# Altium schematic sheet AVD_eFuse_HV_Ctrl.SchDoc: GEM AVD eFuse
size 420 x 297 mm; Author: G.Kasprowicz; CompanyName: WUT ISE; DrawnBy: G.Kasprowicz; Organization: WUT ISE; Address1: PW ISE; Address2: Nowowiejska 15/19 00-665 Warsaw; Address3: gkasprow@gmail.com; Revision: 2; SheetNumber: 3; SheetTotal: 6; ModifiedBy: -; CheckedDate: -; Title2: HV and control; DivGrp: WUT ISE; Designer: G.Kasprowicz; ModifiedDate: -; ProjectName: Sensor Box
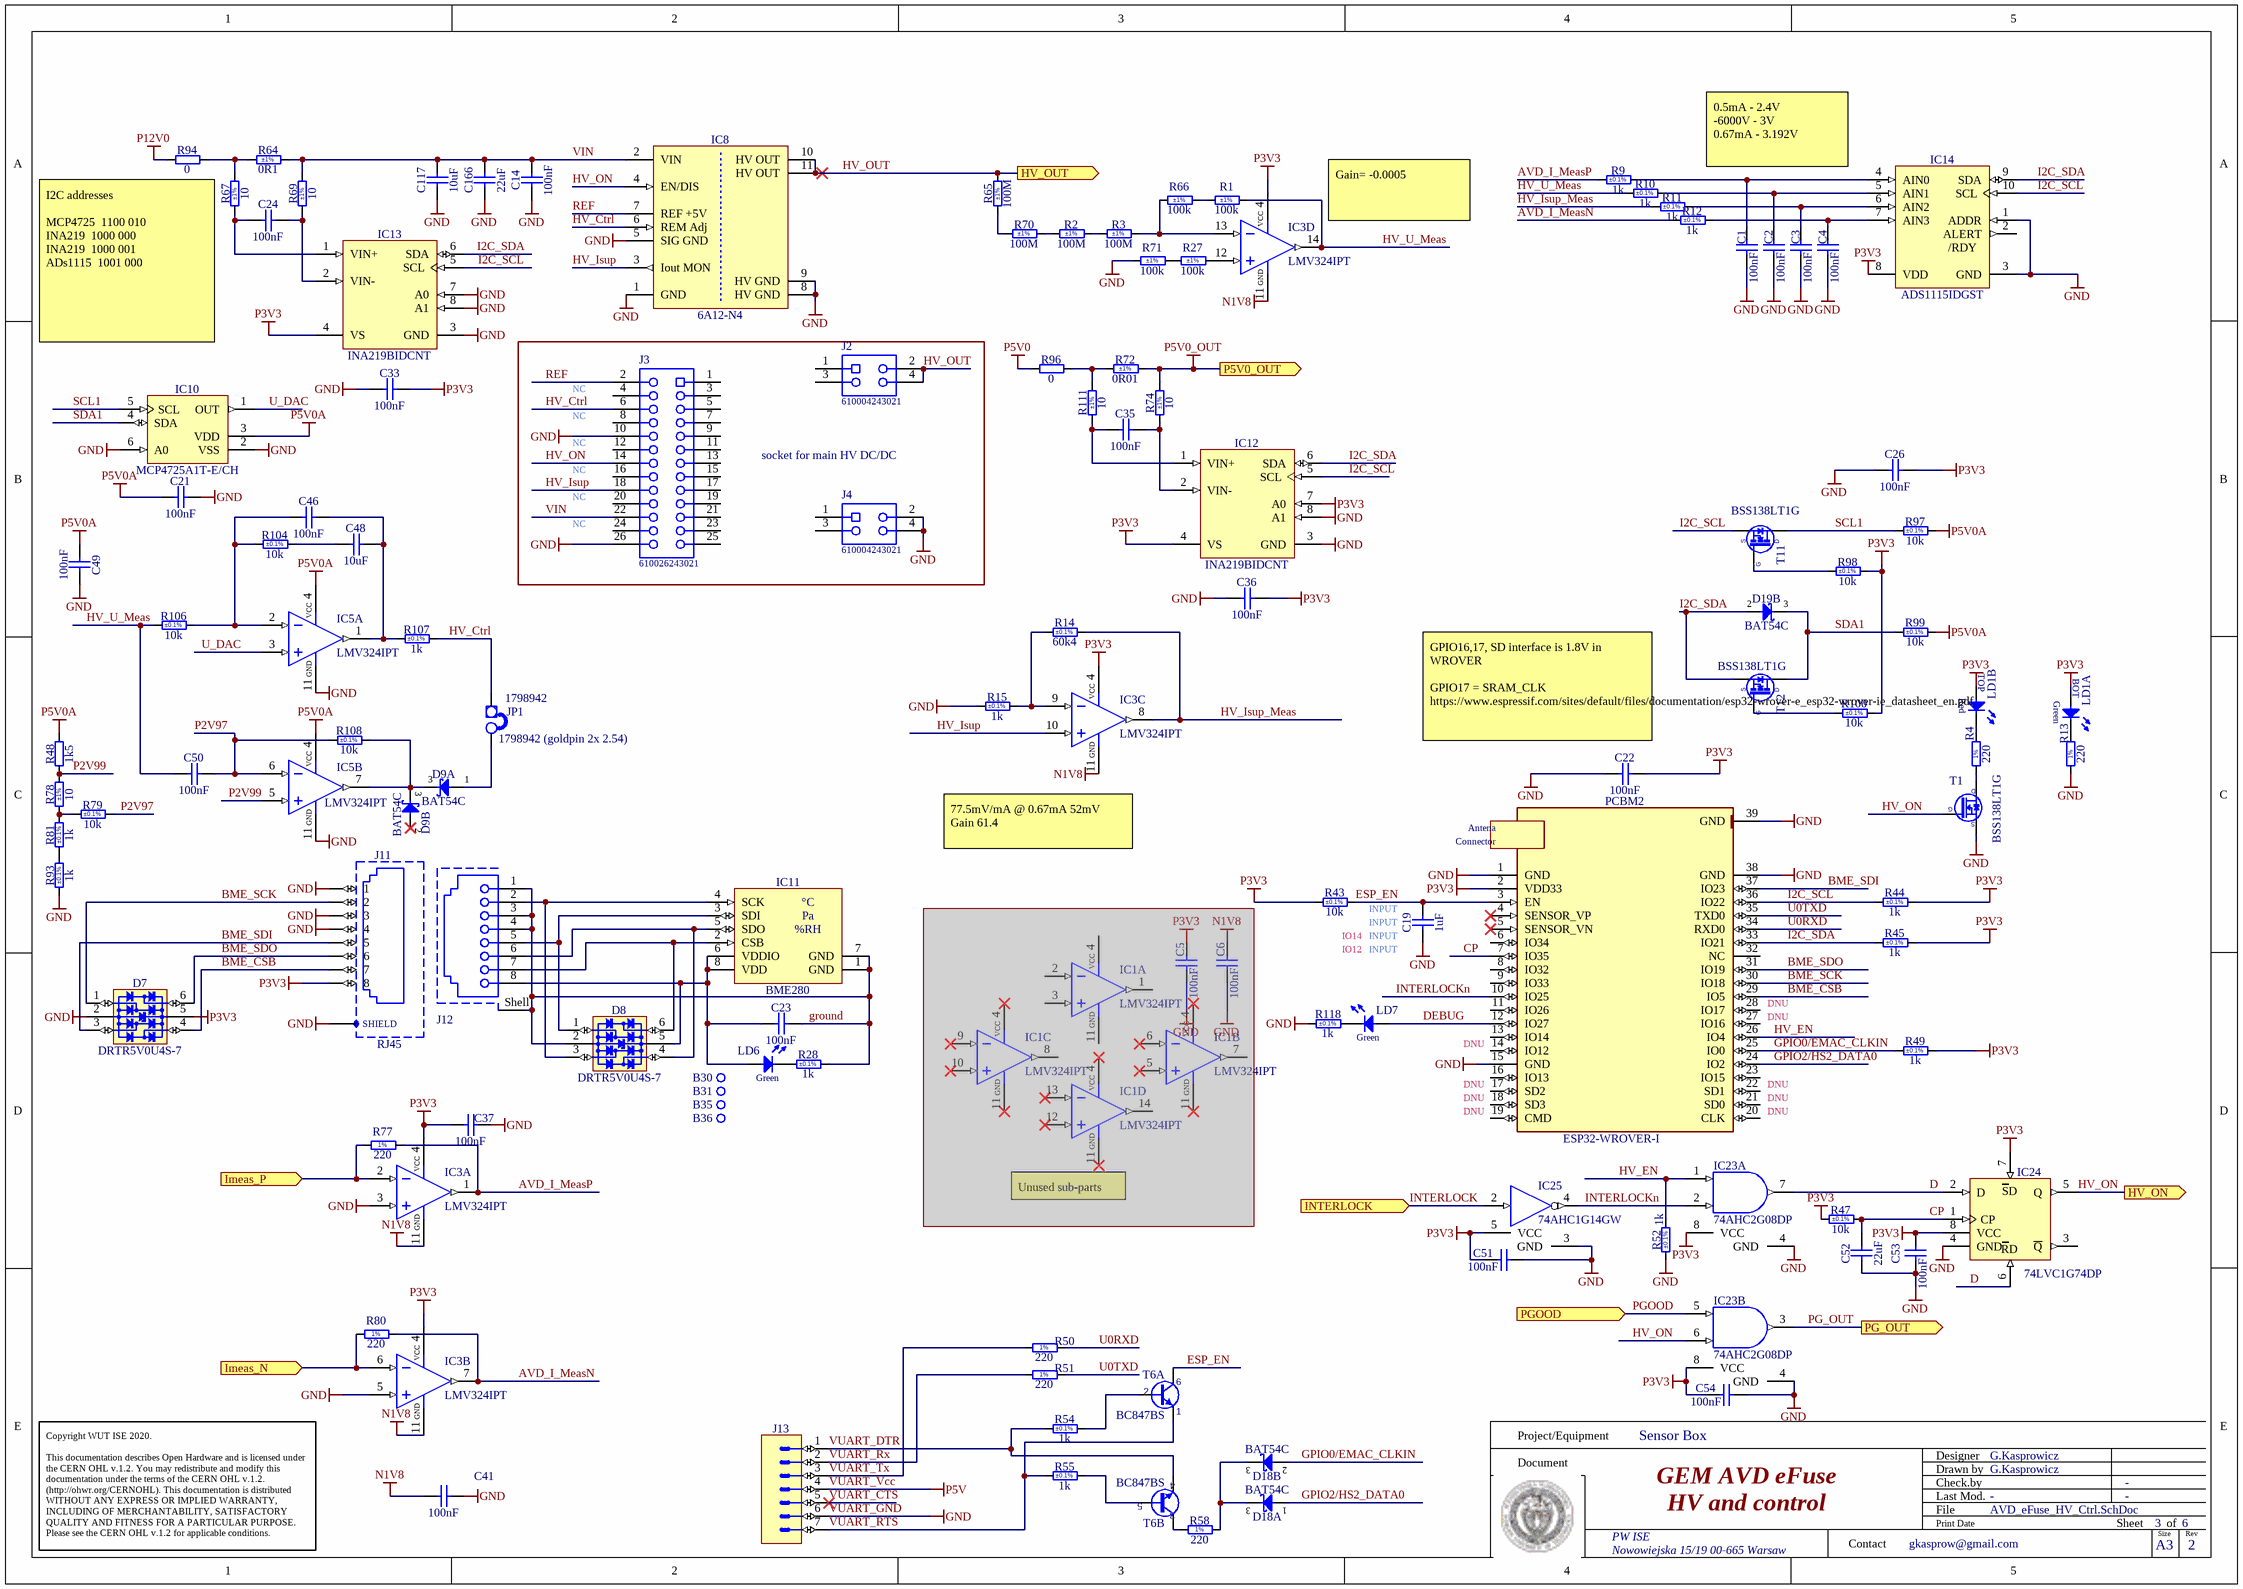
[diagram p0: AVD_eFuse_HV_Ctrl.SchDoc]

## Parts
B30  Plated Hole  [MTG320_550]  (value not drawn)  (no BOM)
B31  Plated Hole  [MTG320_550]  (value not drawn)  (no BOM)
B35  Plated Hole  [MTG320_550]  (value not drawn)  (no BOM)
B36  Plated Hole  [MTG320_550]  (value not drawn)  (no BOM)
C1  100nF  [CAPC1608X87N]
C2  100nF  [CAPC1608X87N]
C3  100nF  [CAPC1608X87N]
C4  100nF  [CAPC1608X87N]
C5  100nF  [CAPC1608X87N]  (masked out: inside a compile mask, not in the netlist)
C6  100nF  [CAPC1608X87N]  (masked out: inside a compile mask, not in the netlist)
C14  100nF  [CAPC1608X87N]
C19  1uF  [CAPC1608X87N]
C21  100nF  [CAPC1608X87N]
C22  100nF  [CAPC1608X87N]
C23  100nF  [CAPC1608X87N]
C24  100nF  [CAPC1608X87N]
C26  100nF  [CAPC1608X87N]
C33  100nF  [CAPC1608X87N]
C35  100nF  [CAPC1608X87N]
C36  100nF  [CAPC1608X87N]
C37  100nF  [CAPC1608X87N]
C41  100nF  [CAPC1608X87N]
C46  100nF  [CAPC1608X87N]
C48  10uF  [CAPC2012X135N]
C49  100nF  [CAPC1608X87N]
C50  100nF  [CAPC1608X87N]
C51  100nF  [CAPC1608X87N]
C52  22uF  [CAPC2012X135N]
C53  100nF  [CAPC1608X87N]
C54  100nF  [CAPC1608X87N]
C117  10uF  [CAPC2012X135N]
C166  22uF  [CAPC2012X135N]
D7  DRTR5V0U4S-7  [SOT65P210X110-6N]
D8  DRTR5V0U4S-7  [SOT65P210X110-6N]
D9  BAT54C  [SOT95P240X130-3N]  (parts A,B of 2)
D18  BAT54C  [SOT95P240X130-3N]  (parts A,B of 2)
D19  BAT54C  [SOT95P240X130-3N]  (part B of 2)
IC1  LMV324IPT  [SOP65P640X110-14N]  (parts A,B,C,D of 4)  (masked out: inside a compile mask, not in the netlist)
IC3  LMV324IPT  [SOP65P640X110-14N]  (parts A,B,C,D of 4)
IC5  LMV324IPT  [SOP65P640X110-14N]  (parts A,B of 4)
IC8  6A12-N4  [DCDC_ADVANCEDENERGY_6A12-N4]  (mechanical)
IC10  MCP4725A1T-E/CH  [SOT95P270X145-6N]
IC11  BME280  [BOSCH_BME280]
IC12  INA219BIDCNT  [SOT65P280X145-8N]
IC13  INA219BIDCNT  [SOT65P280X145-8N]
IC14  ADS1115IDGST  [SOP50P490X110-10N]
IC23  74AHC2G08DP  [SOP65P400X110-8N]  (parts A,B of 2)
IC24  74LVC1G74DP  [SOP65P400X110-8N]
IC25  74AHC1G14GW  [SOT65P212X110-5N]
J2  610004243021  [610004243021]
J3  610026243021  [610026243021]
J4  610004243021  [610004243021]
J11  RJ45  [WURTH_615 008 142 21]
J12  634108150321  [634108150321]  (value not drawn)
J13  Header 7  [SAMTEC_TSW-107-07-L-S-LL]  (value not drawn)
JP1  1798942 (goldpin 2x 2.54)  Manufacturer Part Number: 1798942  [jump]
LD1  Red/Green  [LED_DIALIGHT_553-0112-200F]  (value not drawn)  (parts A,B of 2)
LD6  Green  [LED_KINGBRIGHT_KP-1608CGCK]
LD7  Green  [LED_KINGBRIGHT_KP-1608CGCK]
PCBM2  ESP32-WROVER-I  [PCBM_ESP32-WROVER-I]
R1  100k  Tolerance: ±1%  [RESC1608X55N]
R2  100M  Tolerance: ±1%  [RES_VISHAY_CRHV2010A]
R3  100M  Tolerance: ±1%  [RES_VISHAY_CRHV2010A]
R4  220  [RESC1005X40N]
R9  1k  Tolerance: ±0.1%  [RESC1608X55N]
R10  1k  Tolerance: ±0.1%  [RESC1608X55N]
R11  1k  Tolerance: ±0.1%  [RESC1608X55N]
R12  1k  Tolerance: ±0.1%  [RESC1608X55N]
R13  220  [RESC1005X40N]
R14  60k4  Tolerance: ±0.1%  [RESC1608X55N]
R15  1k  Tolerance: ±0.1%  [RESC1608X55N]
R27  100k  Tolerance: ±1%  [RESC1608X55N]
R28  1k  Tolerance: ±0.1%  [RESC1608X55N]
R43  10k  Tolerance: ±0.1%  [RESC1608X64N]
R44  1k  Tolerance: ±0.1%  [RESC1608X55N]
R45  1k  Tolerance: ±0.1%  [RESC1608X55N]
R47  10k  Tolerance: ±0.1%  [RESC1608X64N]
R48  1k5  [RESC1005X40N]
R49  1k  Tolerance: ±0.1%  [RESC1608X55N]
R50  220  [RESC1005X40N]
R51  220  [RESC1005X40N]
R52  1k  Tolerance: ±0.1%  [RESC1608X55N]
R54  1k  Tolerance: ±0.1%  [RESC1608X55N]
R55  1k  Tolerance: ±0.1%  [RESC1608X55N]
R58  220  [RESC1005X40N]
R64  0R1  Tolerance: ±1%  [RESC3216X65N]
R65  100M  Tolerance: ±1%  [RES_VISHAY_CRHV2010A]
R66  100k  Tolerance: ±1%  [RESC1608X55N]
R67  10  Tolerance: ±1%  [RESC1005X40N]
R69  10  Tolerance: ±1%  [RESC1005X40N]
R70  100M  Tolerance: ±1%  [RES_VISHAY_CRHV2010A]
R71  100k  Tolerance: ±1%  [RESC1608X55N]
R72  0R01  Tolerance: ±1%  [RESC3216X80N]
R74  10  Tolerance: ±1%  [RESC1005X40N]
R77  220  [RESC1005X40N]
R78  10  Tolerance: ±1%  [RESC1005X40N]
R79  10k  Tolerance: ±0.1%  [RESC1608X64N]
R80  220  [RESC1005X40N]
R81  1k  Tolerance: ±0.1%  [RESC1608X55N]
R93  1k  Tolerance: ±0.1%  [RESC1608X55N]
R94  0  [RESC3216X65N]
R96  0  [RESC3216X65N]
R97  10k  Tolerance: ±0.1%  [RESC1608X64N]
R98  10k  Tolerance: ±0.1%  [RESC1608X64N]
R99  10k  Tolerance: ±0.1%  [RESC1608X64N]
R100  10k  Tolerance: ±0.1%  [RESC1608X64N]
R104  10k  Tolerance: ±0.1%  [RESC1608X64N]
R106  10k  Tolerance: ±0.1%  [RESC1608X64N]
R107  1k  Tolerance: ±0.1%  [RESC1608X55N]
R108  10k  Tolerance: ±0.1%  [RESC1608X64N]
R111  10  Tolerance: ±1%  [RESC1005X40N]
R118  1k  Tolerance: ±0.1%  [RESC1608X55N]
T1  BSS138LT1G  [SOT95P240X110-3N]
T6  BC847BS  [SOT65P210X110-6N]  (parts A,B of 2)
T11  BSS138LT1G  [SOT95P240X110-3N]
T12  BSS138LT1G  [SOT95P240X110-3N]

## Blocks framed on the sheet
socket for main HV DC/DC: J2-J4

## Ports
HV_ON (out, see GEM_AVD_eFuse[2B]), HV_OUT (out, see GEM_AVD_eFuse[2B]), Imeas_N (in, see GEM_AVD_eFuse[2C]), Imeas_P (in, see GEM_AVD_eFuse[2C]), INTERLOCK (in, see GEM_AVD_eFuse[2C]), P5V0_OUT (out, see GEM_AVD_eFuse[2B]), PG_OUT (out, see GEM_AVD_eFuse[2C]), PGOOD (in, see GEM_AVD_eFuse[2B], AVD_eFuse_LV_Supply[1D])

## Nets
N1V8: C41.1 IC3.11(GND)
P3V3: C22.2 C26.2 C33.2 C36.2 C37.1 C51.2 C53.1 C54.2 D7.5(VBUS) IC3.4(V+) IC12.4(VS) IC12.7(A0) IC13.4(VS) IC14.8(VDD) IC23.8(VCC) IC24.7(~{S}D) IC24.8(VCC) IC25.5(VCC) J11.8 LD1.2(A) LD1.4(A) PCBM2.2(VDD33) R43.1 R44.2 R45.2 R47.1 R49.2 R98.2 R100.2
P5V0: R96.1
P5V0_OUT: R72.2 R74.2 ; port P5V0_OUT
P5V0A: C21.1 C49.1 IC5.4(V+) IC10.3(VDD) R48.2 R97.2 R99.2
P12V0: R94.1
VUART_GND: C1.1 C2.1 C3.1 C4.1 C14.1 C19.1 C21.2 C22.1 C26.1 C33.1 C36.1 C37.2 C41.2 C49.2 C51.1 C52.1 C53.2 C54.1 C117.1 C166.1 D7.2(GND) IC3.3(IN+) IC3.5(IN+) IC5.11(GND) IC8.1(GND) IC8.5(SIG_GND) IC8.8(HV_GND) IC8.9(HV_GND) IC10.2(VSS) IC10.6(A0) IC12.3(GND) IC12.8(A1) IC13.3(GND) IC13.7(A0) IC13.8(A1) IC14.1(ADDR) IC14.3(GND) IC23.4(GND) IC24.4(GND) IC25.3(GND) J3.10 J3.26 J4.2 J4.4 J11.1 J11.3 J11.4 J11.SHIELD J13.6 PCBM2.1(GND) PCBM2.15(GND) PCBM2.38(GND) PCBM2.39(GND) R13.1 R15.1 R52.1 R71.1 R93.1 R118.1 T1.2(S)  [also labelled GND]
VUART_Vcc: J13.4  [also labelled P5V]
AVD_I_MeasN: IC3.7(OUT) R12.1 R80.2
AVD_I_MeasP: IC3.1(OUT) R9.1 R77.2
BME_CSB: D7.4(I/O3) J11.7 PCBM2.29(IO5)
BME_SCK: D7.1(I/O1) J11.2 PCBM2.30(IO18)
BME_SDI: D7.3(I/O2) J11.5 PCBM2.37(IO23)
BME_SDO: D7.6(I/O4) J11.6 PCBM2.31(IO19)
CP: C52.2 IC24.1(CP) PCBM2.7(IO35) R47.2
D: IC23.7(Y) IC24.2(D) IC24.6(~{RD})
DEBUG: LD7.2(A) PCBM2.12(IO27)
ESP_EN: C19.2 PCBM2.3(EN) R43.2 T6.6(C)
GPIO0/EMAC_CLKIN: D18.2(A) PCBM2.25(IO0) R49.1
GPIO2/HS2_DATA0: D18.1(A) PCBM2.24(IO2)
ground: C23.2 D8.2(GND) IC11.1(GND) IC11.7(GND) J12.1 J12.3 J12.4 J12.Shell R28.2
HV_Ctrl: IC8.6(REM_Adj) J3.6 JP1.1(E1) R107.2
HV_EN: IC23.1(A) PCBM2.26(IO4) R52.2
HV_Isup: IC3.10(IN+) IC8.3(Iout_MON) J3.18
HV_Isup_Meas: IC3.8(OUT) R11.1 R14.2
HV_ON: IC8.4(EN/DIS) IC23.6(B) IC24.5(Q) J3.14 T1.1(G) ; port HV_ON
HV_OUT: IC8.10(HV_OUT) IC8.11(HV_OUT) J2.2 J2.4 R65.2 ; port HV_OUT
HV_U_Meas: C50.1 IC3.14(OUT) R1.2 R10.1 R106.1
I2C_SCL: IC12.5(SCL) IC13.5(SCL) IC14.10(SCL) PCBM2.36(IO22) R44.1 T11.2(S)
I2C_SDA: D19.2(A) IC12.6(SDA) IC13.6(SDA) IC14.9(SDA) PCBM2.33(IO21) R45.1 T12.2(S)
Imeas_N: IC3.6(IN-) R80.1 ; port Imeas_N
Imeas_P: IC3.2(IN-) R77.1 ; port Imeas_P
INTERLOCK: IC25.2(IN) ; port INTERLOCK
INTERLOCKn: IC23.2(B) IC25.4(OUT) PCBM2.10(IO25)
P2V97: C50.2 IC5.6(IN-) R79.2 R108.1
P2V99: IC5.5(IN+) R48.1 R78.2
PG_OUT: IC23.3(Y) ; port PG_OUT
PGOOD: IC23.5(A) ; port PGOOD
REF: IC8.7(REF_+5V) J3.2
SCL1: IC10.5(SCL) R97.1 T11.3(D)
SDA1: D19.3(COMC) IC10.4(SDA) R99.1 T12.3(D)
U0RXD: PCBM2.34(RXD0) R50.2
U0TXD: PCBM2.35(TXD0) R51.2
U_DAC: IC5.3(IN+) IC10.1(OUT)
VIN: C14.2 C117.2 C166.2 IC8.2(VIN) J3.22 R64.2 R69.2
VUART_CTS: J13.5
VUART_DTR: J13.1 R54.1 T6.4(E)
VUART_RTS: J13.7 R55.1 T6.1(E)
VUART_Rx: J13.2 R51.1
VUART_Tx: J13.3 R50.1
NetC1_2: C1.2 IC14.4(AIN0) R9.2
NetC2_2: C2.2 IC14.5(AIN1) R10.2
NetC3_2: C3.2 IC14.6(AIN2) R11.2
NetC4_2: C4.2 IC14.7(AIN3) R12.2
NetC23_1: C23.1 D8.5(VBUS) IC11.6(VDDIO) IC11.8(VDD) J12.8 LD6.2(A)
NetC24_1: C24.1 IC13.1(VIN+) R67.1
NetC24_2: C24.2 IC13.2(VIN-) R69.1
NetC35_1: C35.1 IC12.1(VIN+) R111.1
NetC35_2: C35.2 IC12.2(VIN-) R74.1
NetC46_1: C46.1 IC5.2(IN-) R104.1 R106.2
NetC46_2: C46.2 C48.2 IC5.1(OUT) R107.1
NetC48_1: C48.1 R104.2
NetD8_1: D8.1(I/O1) IC11.3(SDI) J12.5
NetD8_3: D8.3(I/O2) IC11.4(SCK) J12.2
NetD8_4: D8.4(I/O3) IC11.5(SDO) J12.6
NetD8_6: D8.6(I/O4) IC11.2(CSB) J12.7
NetD9_1: D9.1(A) JP1.2(E2)
NetD9_3: D9.3(COMC) IC5.7(OUT) R108.2
NetD18_3: D18.3(COMC) R58.2
NetIC3_9: IC3.9(IN-) R14.1 R15.2
NetIC3_12: IC3.12(IN+) R27.2
NetIC3_13: IC3.13(IN-) R3.2 R66.1
NetLD1_1: LD1.1(C) R13.2
NetLD1_3: LD1.3(C) R4.2
NetLD6_1: LD6.1(C) R28.1
NetLD7_1: LD7.1(C) R118.2
NetR1_1: R1.1 R66.2
NetR2_1: R2.1 R70.2
NetR2_2: R2.2 R3.1
NetR4_1: R4.1 T1.3(D)
NetR27_1: R27.1 R71.2
NetR54_2: R54.2 T6.2(B)
NetR55_2: R55.2 T6.5(B)
NetR58_1: R58.1 T6.3(C)
NetR64_1: R64.1 R67.2 R94.2
NetR65_1: R65.1 R70.1
NetR72_1: R72.1 R96.2 R111.2
NetR78_1: R78.1 R79.1 R81.2
NetR81_1: R81.1 R93.2
NetR98_1: R98.1 T11.1(G)
NetR100_1: R100.1 T12.1(G)

Not connected (* = marked no-connect by the designer): B30 1; B31 1; B35 1; B36 1; D9 2(A)*; IC14 2(ALERT); IC24 3(~{Q}); J2 1 3; J3 1 3 4 5 7 8 9 11 12 13 15 16 17 19 20 21 23 24 25; J4 1 3; PCBM2 4(SENSOR_VP)* 5(SENSOR_VN)* 6(IO34) 8(IO32) 9(IO33) 11(IO26) 13(IO14) 14(IO12) 16(IO13) 17(SD2) 18(SD3) 19(CMD) 20(CLK) 21(SD0) 22(SD1) 23(IO15) 27(IO16) 28(IO17) 32(NC)

## Notes on the sheet
- 0.5mA - 2.4V
  -6000V - 3V
  0.67mA - 3.192V
- (near IC3) Gain= -0.0005
- I2C addresses
  MCP4725		1100 010
  INA219		1000 000
  INA219		1000 001
  ADs1115		1001 000
- NC
- (near C22) GPIO16,17, SD interface is 1.8V in WROVER
  GPIO17 = SRAM_CLK
  https://www.espressif.com/sites/default/files/documentation/esp32-wrover-e_esp32-wrover-ie_datasheet_en.pdf
- (near IC3) 77.5mV/mA @ 0.67mA 52mV
  Gain 61.4
- (near R43) IO14
- INPUT
- IO12
- (near PCBM2) DNU
- (near IC1) Unused sub-parts
- Project/Equipment
- Document
- Designer
- Drawn by
- Check.by
- Copyright WUT ISE 2020.
  This documentation describes Open Hardware and is licensed under the CERN OHL v.1.2. You may redistribute and modify this documentation under the terms of the CERN OHL v.1.2. (http://ohwr.org/CERNOHL). This documentation is distributed WITHOUT ANY EXPRESS OR IMPLIED WARRANTY, INCLUDING OF MERCHANTABILITY, SATISFACTORY QUALITY AND FITNESS FOR A PARTICULAR PURPOSE. Please see the CERN OHL v.1.2 for applicable conditions.
- Contact
- File
- Last Mod.
- Print Date
- Sheet
- Size
- A3
- of
- Rev
- (in symbol 74LVC1G74DP) SD; RD
- (in symbol ADS1115IDGST) /RDY
- (in symbol BME280) °C; Pa; %RH
- (in symbol LED_DIALIGHT_553-0112-200F, part A) BOT; Green
- (in symbol LED_DIALIGHT_553-0112-200F, part B) TOP; Red
- (in symbol OA_LMV324_TSSOP, part A) VCC
- (in symbol OA_LMV324_TSSOP, part B) VCC
- (in symbol OA_LMV324_TSSOP, part C) VCC
- (in symbol OA_LMV324_TSSOP, part D) VCC
- (in symbol PCBM_ESP32-WROVER-I) Antena; Connector
- (in symbol R0402_220R_1%_0.0625W_100PPM) 1%

## Library data of the parts
B30 B31 B35 B36 = PLATED_HOLE3.2_PAD5.5: Single Terminal Socket; Part Description: Plated Through Hole: Hole Dia.=3.2mm Pad Dia.=5.5mm; Mounted: No; Part Number: PLATED_HOLE3.2_PAD5.5; Component Type: Standard (No BOM); Pin Count: 1; Family: Plated Hole; Socket: No; SMD: No; Sense: No; Status: None; ComponentHeight: 0mm; HelpURL: Undefined; Author: CERN DEM JMW; CreateDate: 01.10.2012; LatestRevisionDate: 01.10.2012; PackageDescription: Plated Through Hole: Hole Dia.=3.2mm Pad Dia.=5.5mm
C1-C6 C14 C21-C24 C26 C33 C35-C37 C41 C46 C49-C51 C53 C54 = CC0603_100NF_50V_10%_X5R: Non-polarised capacitor; Part Description: SMD Multilayer Chip Ceramic Capacitor; Manufacturer: GENERIC; Manufacturer1 Part Number: C1608X5R1H104K080; Voltage: 50V; TC: X5R; Tolerance: ±10%; Part Number: CC0603_100NF_50V_10%_X5R; Component Kind: Standard; Component Type: Standard; Pin Count: 2; Value: 100nF; Status: None; Manufacturer Part Number: CC0603_100NF_50V_10%_X5R; Case: 0603; Mounted: Yes; Socket: No; SMD: Yes; Sense: No; Manufacturer1 Example: TDK; Manufacturer1 ComponentHeight: 0.9mm; HelpURL: \\cern.ch\dfs\Applications\Altium\Datasheets\CC0603_X5R_TDK_C.pdf; Author: CERN DEM MR; CreateDate: 08.01.2016; LatestRevisionDate: 08.01.2016
C19 = CC0603_1UF_25V_10%_X7R: Non-polarised capacitor; Part Description: SMD Multilayer Chip Ceramic Capacitor; Manufacturer: GENERIC; Manufacturer1 Part Number: GRM188R71E105KA12D; Voltage: 25V; TC: X7R; Tolerance: ±10%; Part Number: CC0603_1UF_25V_10%_X7R; Component Kind: Standard; Component Type: Standard; Pin Count: 2; Value: 1uF; Status: None; Manufacturer Part Number: CC0603_1UF_25V_10%_X7R; Case: 0603; Mounted: Yes; Socket: No; SMD: Yes; Sense: No; Manufacturer1 Example: MURATA; Manufacturer1 ComponentHeight: 0.9mm; HelpURL: \\cern.ch\dfs\Applications\Altium\Datasheets\CC0603_X7R_MURATA.pdf; Author: CERN DEM JLC; CreateDate: 18/01/2011; LatestRevisionDate: 18/01/2011
C48 C117 = CC0805_10UF_16V_10%_X5R: Non-polarised capacitor; Part Description: SMD Multilayer Chip Ceramic Capacitor; Manufacturer: GENERIC; Manufacturer1 Part Number: C0805C106K4PAC; Voltage: 16V; TC: X5R; Tolerance: ±10%; Part Number: CC0805_10UF_16V_10%_X5R; Component Kind: Standard; Component Type: Standard; Pin Count: 2; Value: 10uF; Status: Preferred; Manufacturer Part Number: CC0805_10UF_16V_10%_X5R; Case: 0805; Mounted: Yes; Socket: No; SMD: Yes; Manufacturer1 Example: KEMET; Manufacturer1 ComponentHeight: 1.4mm; HelpURL: \\cern.ch\dfs\Applications\Altium\Datasheets\CC1206_X5R_KEMET.pdf; Author: CERN DEM JLC; CreateDate: 03.12.2007; LatestRevisionDate: 03.12.2007; Sense: No
C52 C166 = CC0805_22UF_16V_10%_X5R: Non-polarised capacitor; Part Description: SMD Multilayer Chip Ceramic Capacitor; Manufacturer: GENERIC; Manufacturer1 Part Number: C2012X5R1C226KT; Voltage: 16V; TC: X5R; Tolerance: ±10%; Part Number: CC0805_22UF_16V_10%_X5R; Component Kind: Standard; Component Type: Standard; Pin Count: 2; Value: 22uF; Status: Preferred; Manufacturer Part Number: CC0805_22UF_16V_10%_X5R; Case: 0805; Mounted: Yes; Socket: No; SMD: Yes; Sense: No; Manufacturer1 Example: TDK; Manufacturer1 ComponentHeight: 1.35mm; HelpURL: \\cern.ch\dfs\Applications\Altium\Datasheets\CC0805_X5R_TDK_C.pdf; Author: CERN DEM JLC; CreateDate: 25.10.2012; LatestRevisionDate: 25.10.2012
D7 D8 = D_TVS_DRTR5V0U4S-7: Integrated Quad Ultra-Low Capacitance ESD Protection; Part Description: Integrated Quad Ultra-Low Capacitance ESD (±8kV) Protection; Manufacturer: DIODES; PressFit: No; Bonding: No; Status Comment: Active; Part Number: DRTR5V0U4S-7; Component Kind: Standard; Component Type: Standard; Device: DRTR5V0U4S-7; PackageDescription: SOT363, SC70-6, 0.65mm Pitch; 6 Pin, 1.25mm W X 2.00mm L X 1.10mm H body, IPC Medium Density; Status: Active; Manufacturer Part Number: DRTR5V0U4S-7; Pin Count: 6; Case: SOT363; Mounted: Yes; Socket: No; SMD: Yes; Sense: No; ComponentHeight: 1.1mm; HelpURL: \\cern.ch\dfs\Applications\Altium\Datasheets\PRTR5V0U4Y.pdf; Author: GK; CreateDate: 24.01.2017; LatestRevisionDate: 14.09.2020
D9 D18 D19 = BAT54C: Dual Common Cathode Schottky Diodes; Part Description: Dual Common Cathode Small Signal Schottky Diode; Manufacturer: FAIRCHILD SEMICONDUCTOR; Voltage: 30V; Power: 200mA; PressFit: No; Bonding: No; Part Number: BAT54C; Component Kind: Standard; Component Type: Standard; Device: BAT54C; PackageDescription: SOT23 3-Leads, Pitch 0.95mm - Body 1.3x2.9mm, IPC Medium Density; Manufacturer Part Number: BAT54C; Pin Count: 3; Case: SOT23-3; Mounted: Yes; Socket: No; SMD: Yes; Sense: No; ComponentHeight: 1.30mm; HelpURL: \\cern.ch\dfs\Applications\Altium\Datasheets\BAT54C.pdf; Author: CERN DEM JLC; CreateDate: 17.09.2009; LatestRevisionDate: 27.05.2010
IC1 IC3 IC5 = OA_LMV324_TSSOP: Quad Operational Amplifier; Part Description: Quad Low-Voltage Rail-To-Rail Output Operational Amplifier; Manufacturer: TEXAS INSTRUMENTS; PressFit: No; Bonding: No; Table: Operational Amplifiers; Part Number: LMV324IPT; Component Kind: Standard; Component Type: Standard; Device: LMV324IPT; PackageDescription: TSSOP 14, Pitch 0.65 mm - Body 5x86.4mm, IPC Medium Density; Manufacturer Part Number: LMV324IPT; Pin Count: 14; Case: TSSOP14; Mounted: Yes; Socket: No; SMD: Yes; ComponentHeight: 1.80mm; Author: GK; HelpURL: \\cern.ch\dfs\Applications\Altium\Datasheets\LMV324ID.pdf; CreateDate: 2011-08-24; LatestRevisionDate: 2011-08-24
IC8 = 6A12-N4: HVP (HIGHT VOLTAGE PRODUCTS), AA Series, High Voltage DC-DC Converter; Part Description: 12V to -6000V, 4W Ultravolt A Series High Voltage Biasing Supply DC-DC converter; Manufacturer: ADVANCED ENERGY; PressFit: No; Bonding: No; Part Number: 6A12-N4; Component Type: Standard; Device: 6A12-N4; PackageDescription: Ultravolt A Series High Voltage Biasing Supply DC-DC converter; Manufacturer Part Number: 6A12-N4; Pin Count: 11; Mounted: Yes; Socket: No; SMD: No; Sense: No; ComponentHeight: 20.7mm; HelpURL: \\cern.ch\dfs\Applications\Altium\Datasheets\ADVANCEDENERGY_ULTRAVOLT_A_SERIES.pdf; Author: CERN DEM HF; CreateDate: 26.05.2023; LatestRevisionDate: 26.05.2023
IC10 = MCP4725A1T-E/CH: 12-Bit Digital-to-Analog Converter with EEPROM Memory; Manufacturer: MICROCHIP TECHNOLOGY; PressFit: No; Bonding: No; Part Number: MCP4725A1T-E/CH; Component Kind: Standard; Component Type: Standard; Device: MCP4725A1T-E/CH; PackageDescription: SOT, 0.95mm Pitch; 6 Pin,1.55mm W X 2.90mm L X 1.45mm H body, IPC Medium Density; Part Description: 12-Bit Digital-to-Analog Converter with EEPROM Memory; Manufacturer Part Number: MCP4725A1T-E/CH; Pin Count: 6; Case: SOT23-6; Mounted: Yes; Socket: No; SMD: Yes; Sense: No; ComponentHeight: 1.45mm; Author: CERN DEM BC; HelpURL: \\cern.ch\dfs\Applications\Altium\Datasheets\MCP4725A1T-E.pdf; CreateDate: 08.09.2020; LatestRevisionDate: 08.09.2020
IC11 = BME280: Digital Humidity, Pressure  and Temperature Sensor; Manufacturer: BOSCH; PressFit: No; Sense Comment: Soldering Limitation and Cleaning Limitation; Bonding: No; Status Comment: Sensitive (See Sensitive Field); Part Number: BME280; Component Kind: Standard; Component Type: Standard; Device: BME280; PackageDescription: BOSCH Case for BME280, 8 Pin, Pitch 0.65mm, Body 2.5 x 2.5mm; Status: Not Recommended; Part Description: Digital Humidity, Pressure  and Temperature Sensor; Manufacturer Part Number: BME280; Pin Count: 8; Mounted: Yes; Socket: No; SMD: Yes; Sense: Yes; ComponentHeight: 1mm; HelpURL: \\cern.ch\dfs\Applications\Altium\Datasheets\BME280.pdf; Author: CERN DEM JLC; CreateDate: 02.05.2018; LatestRevisionDate: 02.05.2018
IC12 IC13 = INA219BIDCNT: Zero-Drift, Bi-Directional CURRENT/POWER MONITOR with I2C™ Interface; Manufacturer: TEXAS INSTRUMENTS; PressFit: No; Bonding: No; Part Number: INA219BIDCNT; Component Kind: Standard; Component Type: Standard; Device: INA219BIDCNT; PackageDescription: SOT, 0.65mm pitch; 8 pin, 1.625mm W X 2.90mm L X 1.45mm H body, IPC Medium Density; Part Description: Zero-Drift, Bi-Directional CURRENT/POWER MONITOR with I2C™ Interface; Manufacturer Part Number: INA219BIDCN; Pin Count: 8; Case: SOT23-8; Mounted: Yes; Socket: No; SMD: Yes; Sense: No; ComponentHeight: 1.45mm; Author: CERN DEM JLC; HelpURL: \\cern.ch\dfs\Applications\Altium\Datasheets\INA219BIDCNT.pdf; CreateDate: 24.09.2013; LatestRevisionDate: 13.06.2022
IC14 = ADS1115IDGST: Ultra-Small, Low-Power, 16-Bit Analog-to-Digital Converter with Internal Reference; Part Description: Ultra-Small, Low-Power, 4 Channels 16-Bit Analog-to-Digital Converter with Internal Reference; Manufacturer: TEXAS INSTRUMENTS; PressFit: No; Bonding: No; Part Number: ADS1115IDGST; Component Kind: Standard; Component Type: Standard; Device: ADS1115IDGST; PackageDescription: SOP, 0.50mm Pitch; 10 Pin, 3.00mm W X 3.00mm L X 1.10mm H body, IPC Medium Density; Manufacturer Part Number: ADS1115IDGS; Pin Count: 10; Case: MSOP10; Mounted: Yes; Socket: No; SMD: Yes; Sense: No; ComponentHeight: 1.1mm; Author: CERN DEM JLC; HelpURL: \\cern.ch\dfs\Applications\Altium\Datasheets\ADS1115IDGST.pdf; CreateDate: 29.10.2012; LatestRevisionDate: 13.06.2022
IC23 = 74AHC2G08DP: Dual 2-Input Positive AND Gate; Part Description: Dual 2-Input AND Gate; Manufacturer: NEXPERIA; PressFit: No; Bonding: No; Part Number: 74AHC2G08DP; Component Kind: Standard; Component Type: Standard; Device: 74AHC2G08DP; PackageDescription: SOP, 0.65mm Pitch; 8 Pin, 3.00mm W X 3.00mm L X 1.10mm H body, IPC Medium Density; Manufacturer Part Number: 74AHC2G08DP; Pin Count: 8; Case: TSSOP8; Mounted: Yes; Socket: No; SMD: Yes; Sense: No; ComponentHeight: 1.1mm; Author: CERN DEM BC; HelpURL: \\cern.ch\dfs\Applications\Altium\Datasheets\74AHC2G08DP.pdf; CreateDate: 21.01.2021; LatestRevisionDate: 21.01.2021
IC24 = 74LVC1G74DP: Single D-type flip-flop with set and reset, positive edge trigger; Manufacturer: NXP SEMICONDUCTORS; PressFit: No; Bonding: No; Part Number: 74LVC1G74DP; Component Kind: Standard; Component Type: Standard; Device: 74LVC1G74DP; PackageDescription: SOP, 0.65mm Pitch; 8 pin, 3.00mm W X 3.00mm L X 1.10mm H body, IPC Medium Density; Part Description: Single D-Type Flip-Flop with Set And Reset, Positive Edge Trigger; Manufacturer Part Number: 74LVC1G74DP; Pin Count: 8; Case: TSSOP8; Mounted: Yes; Socket: No; SMD: Yes; Sense: No; ComponentHeight: 1.1mm; Author: CERN DEM JLC; HelpURL: \\cern.ch\dfs\Applications\Altium\Datasheets\74LVC1G74DP.pdf; CreateDate: 26.04.2010; LatestRevisionDate: 26.04.2010
IC25 = 74AHC1G14GW: Single Schmitt-Trigger Inverter; Part Description: Inverting Schmitt Trigger; Manufacturer: NXP SEMICONDUCTORS; PressFit: No; Bonding: No; Part Number: 74AHC1G14GW; Component Kind: Standard; Component Type: Standard; Device: 74AHC1G14GW; PackageDescription: SOT353, SC70-5, 0.65mm Pitch; 5 Pin, 1.25mm W X 2.05mm L X 1.10mm H body, IPC Medium Density; Manufacturer Part Number: 74AHC1G14GW; Pin Count: 3; Case: SOT353; Mounted: Yes; Socket: No; SMD: Yes; Sense: No; ComponentHeight: 1.1mm; Author: CERN DEM JMW; HelpURL: \\cern.ch\dfs\Applications\Altium\Datasheets\74AHC1G14GW.pdf; CreateDate: 30.08.2016; LatestRevisionDate: 30.08.2016
J2 J4 = 610004243021: WR-PHD Socket Header, SMT, pitch 2.54mm, Dual Row, Vertical, 4p; Manufacturer: Wurth Elektronik; Pin Number: 4; Rated Current: 3A; Working Voltage: 250VAC; Withstanding Voltage: 500VAC; Contact Resistance: 20mOhm; ComponentLink1Description: Manufacturer; ComponentLink1URL: http://www.we-online.de; ComponentLink2Description: Datasheet; ComponentLink2URL: https://www.we-online.com/catalog/datasheet/610004243021.pdf; Manufacturer Part Number: 610004243021; Pitch: 2.54mm; Operating Temperature: -40 to +125degC; Mounting Technology: SMT; Packaging: Tube; Gender: Socket Header; Row Number: Dual; Orientation: Vertical
J3 = 610026243021: WR-PHD Socket Header, SMT, pitch 2.54mm, Dual Row, Vertical, 26p; Manufacturer: Wurth Elektronik; Pin Number: 26; Rated Current: 3A; Working Voltage: 250VAC; Withstanding Voltage: 500VAC; Contact Resistance: 20mOhm; ComponentLink1Description: Manufacturer; ComponentLink1URL: http://www.we-online.de; ComponentLink2Description: Datasheet; ComponentLink2URL: https://www.we-online.com/catalog/datasheet/610026243021.pdf; Manufacturer Part Number: 610026243021; Pitch: 2.54mm; Operating Temperature: -40 to +125degC; Mounting Technology: SMT; Packaging: Tube; Gender: Socket Header; Row Number: Dual; Orientation: Vertical
J11 = WURTH_615 008 142 21: Connector RJ45 + Shield; Part Description: 1 Port, Tab-Down, Horizontal Shielded 8P8C RJ45 Modular Jack Socket; Manufacturer: WURTH ELEKTRONIK; PressFit: No; Part Number: WURTH_615 008 142 21; Component Kind: Standard; Component Type: Standard; Pin Count: 10; Family: RJ45; Mounted: Yes; Socket: No; SMD: No; Sense: No; Status: None; Manufacturer Part Number: 615 008 142 21; ComponentHeight: 13.8mm; HelpURL: \\cern.ch\dfs\Applications\Altium\Datasheets\WURTH_615 008 142 21.pdf; Author: CERN DEM JLC; CreateDate: 09.10.2017; LatestRevisionDate: 09.10.2017
J12 = 634108150321: WR-MJ Modular Jack SMT Horizontal Mid-Mount Shielded 8P8C Tab Up; Manufacturer: Wurth Elektronik; Contact Resistance: 20mΩ; Insulation Resistance: 1000MΩ; LED: No; Number of Ports: 1; Rated Current: 1.5A; Shielding: Yes; Working Voltage: 125VAC; Withstanding Voltage: 1000VAC; ComponentLink1Description: Website Link; ComponentLink1URL: https://www.we-online.com/redexpert/article/634108150321?ad; ComponentLink2Description: Datasheet Link; ComponentLink2URL: https://www.we-online.com/redexpert/spec/634108150321?ad; Manufacturer Part Number: 634108150321; Category: Input/Output Connectors; Match Code: WR-MJ; Mount: Surface Mount; Operating Temperature Max: 85°C; Operating Temperature Min: -40°C; Packaging: Tape and Reel; Number of Pins: 8P8C; Orientation: Horizontal
J13 = SAMTEC_TSW-107-07-L-S-LL: Connector 7 Male; Part Description: 7 Contacts, Pitch 2.54mm, Single Row  Through Mount Straigh Header (Post Lead 5.84mm, Tail Lead 2.54mm, Insulator 2.54mm); Manufacturer: SAMTEC; PressFit: No; Part Number: SAMTEC_TSW-107-07-L-S-LL; Component Kind: Standard; Component Type: Standard; Pin Count: 7; Family: Header 7; Mounted: Yes; Socket: No; SMD: No; Sense: No; Status: None; Manufacturer Part Number: TSW-107-07-L-S-LL; ComponentHeight: 8.38mm; HelpURL: \\cern.ch\dfs\Applications\Altium\Datasheets\SAMTEC_TSW-107-07-L-S-LL.pdf; Author: CERN DEM MR; CreateDate: 07.12.2016; LatestRevisionDate: 07.12.2016
JP1 = JUMPER: Supplier 1: Farnell
LD1 = LED_DIALIGHT_553-0112-200F: 2x LED Botom Green, Top Red; Part Description: Dual 3mm LEDs, Red Top, Green Bot, CBI® Circuit Board Indicator; PressFit: No; Bonding: No; Part Number: LED_DIALIGHT_553-0112-200F; Component Kind: Standard; Component Type: Standard; Color: Red/Green; PackageDescription: Dual 3mm LED (Top: Red, Bot: Green), Body 10.55x4.32mm, Pin spacing 2.54mm; Manufacturer: DIALIGHT; Manufacturer Part Number: 553-0112-200F; Pin Count: 4; Mounted: Yes; Socket: No; SMD: No; Sense: No; ComponentHeight: 9.65mm; HelpURL: \\cern.ch\dfs\Applications\Altium\Datasheets\LED_DIALIGHT_553-0XXX-200F.pdf; Author: CERN DEM JMW; CreateDate: 07.06.2013; LatestRevisionDate: 06.02.2020
LD6 LD7 = LED_KINGBRIGHT_KP-1608CGCK: LED Green 1C 2A; Part Description: 1.6x0.8mm SMD Chip Green LED Lamp; PressFit: No; Bonding: No; Part Number: LED_KINGBRIGHT_KP-1608CGCK; Component Kind: Standard; Component Type: Standard; Color: Green; PackageDescription: SMT Green LED, Case 0603, Body L 1.60mm x W 0.80mm x H 1.10mm; Manufacturer: KINGBRIGHT; Manufacturer Part Number: KP-1608CGCK; Pin Count: 2; Case: 0603; Mounted: Yes; Socket: No; SMD: Yes; Sense: No; ComponentHeight: 1.1mm; HelpURL: \\cern.ch\dfs\Applications\Altium\Datasheets\LED_KINGBRIGHT_KP-1608CGCK.pdf; Author: CERN DEM HF; CreateDate: 01.10.2021; LatestRevisionDate: 01.10.2021
PCBM2 = PCBM_ESP32-WROVER-I: Generic WiFi-BT-BLE MCU Module; Part Description: Generic WiFi-BT-BLE MCU Module (IPEX antenna, 32-Mbit PSRAM); Manufacturer: ESPRESSIF; PressFit: No; Bonding: No; Part Number: PCBM_ESP32-WROVER-I; Component Kind: Standard; Component Type: Standard; Device: ESP32-WROVER-I; PackageDescription: Generic WiFi-BT-BLE MCU Module (IPEX antenna) ,Body 18.00mm x 31.4mm; Manufacturer Part Number: ESP32-WROVER-I; Pin Count: 39; Mounted: Yes; Socket: No; SMD: Yes; Sense: No; ComponentHeight: 3.65mm; Author: CERN DEM JLC; HelpURL: \\cern.ch\dfs\Applications\Altium\Datasheets\PCBM_ESP32-WROVER-I.pdf; CreateDate: 14.11.2017; LatestRevisionDate: 14.11.2017
R1 R27 R66 R71 = R0603_100K_1%_0.1W_100PPM: Resistor - 1%; Part Description: General Purpose Thick Film Chip Resistor; Manufacturer: GENERIC; Manufacturer1 Part Number: NRC06F1003TRF; Power: 0.1W; TC: ±100ppm/°C; PressFit: No; Part Number: R0603_100K_1%_0.1W_100PPM; Component Kind: Standard; Component Type: Standard; Pin Count: 2; Value: 100k; Status: Preferred; Manufacturer Part Number: R0603_100K_1%_0.1W_100PPM; Case: 0603; Mounted: Yes; Sense: No; Socket: No; SMD: Yes; Manufacturer1 Example: NIC COMPONENT; Manufacturer1 ComponentHeight: 0.55mm; HelpURL: \\cern.ch\dfs\Applications\Altium\Datasheets\R0603_NIC_NRC.pdf; Author: CERN DEM JLC; CreateDate: 03.12.2007; LatestRevisionDate: 13.03.2008
R2 R3 R65 R70 = R2010_100M_1%_0.5W_100PPM_VISHAY_CRHV2010AF1G00FKET: Resistor - 1%; Part Description: Thick Film Chip Resistor, High Voltage (2kV); Manufacturer: VISHAY TECHNO; Manufacturer Part Number: CRHV2010AF100MFKET; Power: 0.5W; TC: ±100ppm/°C; PressFit: No; Part Number: R2010_100M_1%_0.5W_100PPM_VISHAY_CRHV2010AF1G00FKET; Component Kind: Standard; Component Type: Standard; Pin Count: 2; Value: 100M; Status: None; Case: 2010; Mounted: Yes; Sense: No; Socket: No; SMD: Yes; ComponentHeight: 0.68mm; HelpURL: \\cern.ch\dfs\Applications\Altium\Datasheets\R2010_VISHAY_CRHV.pdf; Author: CERN DEM JLC; CreateDate: 03.06.2015; LatestRevisionDate: 03.06.2015
R4 R13 R50 R51 R58 R77 R80 = R0402_220R_1%_0.0625W_100PPM: Resistor - 1%; Part Description: General Purpose Thick Film Chip Resistor; Manufacturer: GENERIC; Manufacturer1 Part Number: 232270672201L; TC: ±100ppm/°C; PressFit: No; Part Number: R0402_220R_1%_0.0625W_100PPM; Component Kind: Standard; Component Type: Standard; Pin Count: 2; Value: 220; Status: Not Recommended; Power: 0.0625W; Tolerance: ±1%; Manufacturer Part Number: R0402_220R_1%_0.0625W_100PPM; Case: 0402; Mounted: Yes; Sense: No; Socket: No; SMD: Yes; Manufacturer1 Example: YAGEO PHYCOMP; Manufacturer1 ComponentHeight: 0.4mm; HelpURL: \\cern.ch\dfs\Applications\Altium\Datasheets\R0402_Phycomp_RC0402.pdf; Author: CERN DEM JLC; CreateDate: 03.12.2007; LatestRevisionDate: 17.10.2012
R9-R12 R15 R28 R44 R45 R49 R52 R54 R55 R81 R93 R107 R118 = R0603_1K_0.1%_0.063W_10PPM: Resistor - 0.1%; Part Description: Thin Film Chip Resistor; Manufacturer: GENERIC; Manufacturer1 Part Number: RN73C1J1K0BTG; Power: 0.063W; TC: ±10ppm; PressFit: No; Part Number: R0603_1K_0.1%_0.063W_10PPM; Component Kind: Standard; Component Type: Standard; Pin Count: 2; Value: 1k; Status: Not Recommended; Manufacturer Part Number: R0603_1K_0.1%_0.063W_10PPM; Case: 0603; Mounted: Yes; Sense: No; Socket: No; SMD: Yes; Manufacturer1 Example: TYCO HOLSWORTHY; Manufacturer1 ComponentHeight: 0.55mm; HelpURL: \\cern.ch\dfs\Applications\Altium\Datasheets\R0603_Tyco_RN73.pdf; Author: CERN DEM BC; CreateDate: 23.05.2016; LatestRevisionDate: 23.05.2016
R14 = R0603_60K4_0.1%_0.063W_10PPM: Resistor - 0.1%; Part Description: Thin Film Chip Resistor; Manufacturer: GENERIC; Manufacturer1 Part Number: RN73C1J60K4BTDF; Power: 0.063W; TC: ±10ppm; PressFit: No; Part Number: R0603_60K4_0.1%_0.063W_10PPM; Component Kind: Standard; Component Type: Standard; Pin Count: 2; Value: 60k4; Status: Not Recommended; Manufacturer Part Number: R0603_60K4_0.1%_0.063W_10PPM; Case: 0603; Mounted: Yes; Sense: No; Socket: No; SMD: Yes; Manufacturer1 Example: TYCO HOLSWORTHY; Manufacturer1 ComponentHeight: 0.5mm; HelpURL: \\cern.ch\dfs\Applications\Altium\Datasheets\R0603_Tyco_RN73.pdf; Author: CERN DEM JLC; CreateDate: 03.12.2007; LatestRevisionDate: 13.03.2008
R43 R47 R79 R97-R100 R104 R106 R108 = R0603_10K_0.1%_0.1W_25PPM: Resistor - 0.1%; Part Description: Thin Film Chip Resistor; Manufacturer: GENERIC; Manufacturer1 Part Number: ERA3AEB103V; Power: 0.1W; TC: ±25ppm/°C; PressFit: No; Part Number: R0603_10K_0.1%_0.1W_25PPM; Component Kind: Standard; Component Type: Standard; Pin Count: 2; Value: 10k; Status: Not Recommended; Manufacturer Part Number: R0603_10K_0.1%_0.1W_25PPM; Case: 0603; Mounted: Yes; Sense: No; Socket: No; SMD: Yes; Manufacturer1 Example: PANASONIC; Manufacturer1 ComponentHeight: 0.55mm; HelpURL: \\cern.ch\dfs\Applications\Altium\Datasheets\R0603_PANASONIC_ERA.pdf; Author: CERN DEM JMW; CreateDate: 09.11.2015; LatestRevisionDate: 11.01.2017
R48 = R0402_1K5_1%_0.0625W_100PPM: Resistor - 1%; Part Description: General Purpose Thick Film Chip Resistor; Manufacturer: GENERIC; Manufacturer1 Part Number: 232270671502L; TC: ±100ppm/°C; PressFit: No; Part Number: R0402_1K5_1%_0.0625W_100PPM; Component Kind: Standard; Component Type: Standard; Pin Count: 2; Value: 1k5; Status: Not Recommended; Power: 0.0625W; Tolerance: ±1%; Manufacturer Part Number: R0402_1K5_1%_0.0625W_100PPM; Case: 0402; Mounted: Yes; Sense: No; Socket: No; SMD: Yes; Manufacturer1 Example: YAGEO PHYCOMP; Manufacturer1 ComponentHeight: 0.4mm; HelpURL: \\cern.ch\dfs\Applications\Altium\Datasheets\R0402_Phycomp_RC0402.pdf; Author: CERN DEM JLC; CreateDate: 03.12.2007; LatestRevisionDate: 17.10.2012
R64 = R1206_0R1_1%_0.25W_100PPM_YAGEO_PT: Resistor - 1%; Part Description: Current Sensor, Low TCR Chip Resistor; Manufacturer: YAGEO PHYCOMP; Manufacturer Part Number: PT1206FR-070R1L; Power: 0.25W; TC: ±100ppm/°C; PressFit: No; Part Number: R1206_0R1_1%_0.25W_100PPM_YAGEO_PT; Component Kind: Standard; Component Type: Standard; Pin Count: 2; Value: 0R1; Status: None; Case: 1206; Mounted: Yes; Sense: No; Socket: No; SMD: Yes; ComponentHeight: 0.65mm; HelpURL: \\cern.ch\dfs\Applications\Altium\Datasheets\R1206_YAGEO_PT.pdf; Author: CERN DEM JMW; CreateDate: 06.07.2015; LatestRevisionDate: 06.07.2015
R67 R69 R74 R78 R111 = R0402_10R_1%_0.0625W_200PPM: Resistor - 1%; Part Description: General Purpose Thick Film Chip Resistor; Manufacturer: GENERIC; Manufacturer1 Part Number: 232270671009L; TC: ±200ppm/°C; PressFit: No; Part Number: R0402_10R_1%_0.0625W_200PPM; Component Kind: Standard; Component Type: Standard; Pin Count: 2; Value: 10; Status: Not Recommended; Power: 0.0625W; Manufacturer Part Number: R0402_10R_1%_0.0625W_200PPM; Case: 0402; Mounted: Yes; Sense: No; Socket: No; SMD: Yes; Manufacturer1 Example: YAGEO PHYCOMP; Manufacturer1 ComponentHeight: 0.4mm; HelpURL: \\cern.ch\dfs\Applications\Altium\Datasheets\R0402_Phycomp_RC0402.pdf; Author: CERN DEM JLC; CreateDate: 24.06.2009; LatestRevisionDate: 17.10.2012
R72 = R1206_0R01_1%_1W_100PPM_TT_LRMAM1206: Resistor - 1%; Part Description: Low Value Metal Alloy Resistor; Manufacturer: TT Electronics; Manufacturer Part Number: LRMAM1206-R01FT5; Power: 1W; TC: ±100ppm/°C; PressFit: No; Part Number: R1206_0R01_1%_1W_100PPM_TT_LRMAM1206; Component Kind: Standard; Component Type: Standard; Pin Count: 2; Value: 0R01; Status: Not Recommended; Case: 1206; Mounted: Yes; Sense: No; Socket: No; SMD: Yes; ComponentHeight: 0.8mm; HelpURL: \\cern.ch\dfs\Applications\Altium\Datasheets\R1206_TT ELECTRONICS_LRMA.pdf; Author: CERN DEM BC; CreateDate: 29.07.2015; LatestRevisionDate: 29.07.2015
R94 R96 = R1206_0R_JUMPER: Resistor; Part Description: 2A (0.05R Max DC Resistance) Zero Ohm Jumper; Manufacturer: GENERIC; Manufacturer1 Part Number: NRC12Z0; PressFit: No; Part Number: R1206_0R_JUMPER; Component Kind: Standard; Component Type: Standard; Pin Count: 2; Value: 0; Status: Preferred; Manufacturer Part Number: R1206_0R_JUMPER; Case: 1206; Mounted: Yes; Sense: No; Socket: No; SMD: Yes; Manufacturer1 Example: NIC COMPONENT; Manufacturer1 ComponentHeight: 0.65mm; HelpURL: \\cern.ch\dfs\Applications\Altium\Datasheets\R1206_NIC_NRC.pdf; Author: CERN DEM JLC; CreateDate: 03.12.2007; LatestRevisionDate: 13.03.2008
T1 T11 T12 = BSS138LT1G: N-CHANNEL MOSFET WITH DIODE; Part Description: 50V, 200mA N-Channel Enhancement Mode Field-Effect Transistor; Manufacturer: ON SEMICONDUCTOR; PressFit: No; Bonding: No; Part Number: BSS138LT1G; Component Kind: Standard; Component Type: Standard; Device: BSS138LT1G; PackageDescription: SOT23, 0.95mm Pitch; 3 Pin, 1.40mm W X 3.00mm L X 1.10mm H body, IPC Medium Density; Manufacturer Part Number: BSS138L; Pin Count: 3; Case: SOT23-3; Mounted: Yes; Socket: No; SMD: Yes; Sense: No; ComponentHeight: 1.11mm; HelpURL: \\cern.ch\dfs\Applications\Altium\Datasheets\BSS138LT1G.pdf; Author: CERN DEM JLC; CreateDate: 23.03.2009; LatestRevisionDate: 25.05.2022
T6 = BC847BS: 45V 100mA Dual NPN General-Purpose Transistor; Manufacturer: NXP SEMICONDUCTORS; PressFit: No; Bonding: No; Part Number: BC847BS; Component Kind: Standard; Component Type: Standard; Device: BC847BS; PackageDescription: SOT363, SC-88, SOT, 0.65mm Pitch, 6 pin, 1.25mm W X 2.00mm L X 1.10mm H, IPC Medium Density; Part Description: 45V 100mA Dual NPN General-Purpose Transistor; Manufacturer Part Number: BC847BS; Pin Count: 6; Case: SOT363; Mounted: Yes; Socket: No; SMD: Yes; Sense: No; ComponentHeight: 1.1mm; HelpURL: \\cern.ch\dfs\Applications\Altium\Datasheets\BC847BS.pdf; Author: CERN DEM JMW; CreateDate: 10.07.2015; LatestRevisionDate: 10.07.2015